# EAGLE schematic PlanarizerDAQ (EAGLE 9.6.2)
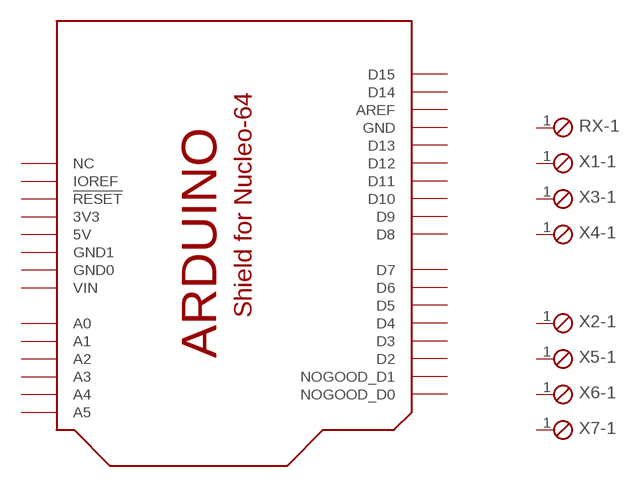
[diagram p0: schematic, sheet 1]

## Parts
RX  SCREWTERM_2P_254  [2POL254]
U$1  SHIELD_FOR_NUCLE0_64_SHORT  [SHIELD_FOR_NUCLEO_64_SHORT]
X1  SCREWTERM_2P_254  [2POL254]
X2  SCREWTERM_2P_254  [2POL254]
X3  SCREWTERM_2P_254  [2POL254]
X4  SCREWTERM_2P_254  [2POL254]
X5  SCREWTERM_2P_254  [2POL254]
X6  SCREWTERM_2P_254  [2POL254]
X7  SCREWTERM_2P_254  [2POL254]
Unconnected: RX.1 RX.2 U$1.A0 U$1.A1 U$1.A2 U$1.A3 U$1.A4 U$1.A5 U$1.AREF U$1.D0(NOGOOD_D0) U$1.D1(NOGOOD_D1) U$1.D2 U$1.D3 U$1.D4 U$1.D5 U$1.D6 U$1.D7 U$1.D8 U$1.D9 U$1.D10 U$1.D11 U$1.D12 U$1.D13 U$1.D14 U$1.D15 U$1.IOREF U$1.NC U$1.NRST(!RESET) X1.1 X1.2 X2.1 X2.2 X3.1 X3.2 X4.1 X4.2 X5.1 X5.2 X6.1 X6.2 X7.1 X7.2

## Power pins joined to a net without a drawn wire
3V3: U$1.3V(3V3)
5V: U$1.5V
GND: U$1.GND
GND0: U$1.GND1(GND0)
GND1: U$1.GND2(GND1)
VIN: U$1.VIN

## Library data of the parts
RX X1-X7 = ME507:SCREWTERM_2P: Screw Terminal Block This part is designed for a screw terminal connector. The 2.54mm (0.100 inch) foorprint can also be used for male or female pin headers such as those on most development boards. One can also solder wires directly into the holes, though this makes modifications or repairs to the system more inconvenient. Larger versions can carry more current.
U$1 = ME507:SHIELD_FOR_NUCLE0_64: Arduino Style Shield for Nucleo-64 This is a board outline with pin locations for an Arduino style shield which fits on top of an STM32 Nucleo-64. Pin names are generic except for Nucleo specific pins such as IOREF. There are two board sizes, the standard which matches the size of an Arduino Uno, and the short version which can be less expensive to produce if you don't need a lot of board area. The outline is on the DIMENSION layer. When making a new board, you must delete the lines which form the default board outline so that this package's outlines control the dimensions of the board. Pins D0 and D1 are connected to a communications port and are not available for general use, so they are labeled as NOGOOD on the symbol and footprints.